# Altium schematic sheet ETAS.SchDoc
size A4
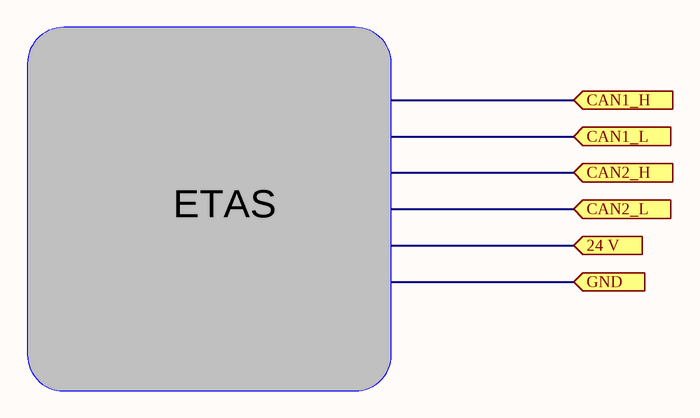
[diagram p0: ETAS.SchDoc]

## Ports
24 V (in, see BSPD[3B], DASH[1B], HV BOX[2A], HV BOX[3B], Rear ECU[1B], VECTOR[3B]), CAN1_H (in, see DASH[1B], Front_ECU[3B], HV BOX[2A], Rear ECU[3B], VECTOR[3B]), CAN1_L (in, see DASH[1B], Front_ECU[3B], HV BOX[2A], Rear ECU[3B], VECTOR[3B]), CAN2_H (in, see Front_ECU[3B], Rear ECU[3B], VECTOR[3B]), CAN2_L (in, see Front_ECU[3B], Rear ECU[3B], VECTOR[3B]), GND (in, see BSPD[3B], DASH[1B], E.M BOX[3B], Front_ECU[3B], HV BOX[2A], HV BOX[3A], HV BOX[3B], Rear ECU[1B], Rear ECU[3B], VECTOR[3C])

## Notes on the sheet
- ETAS